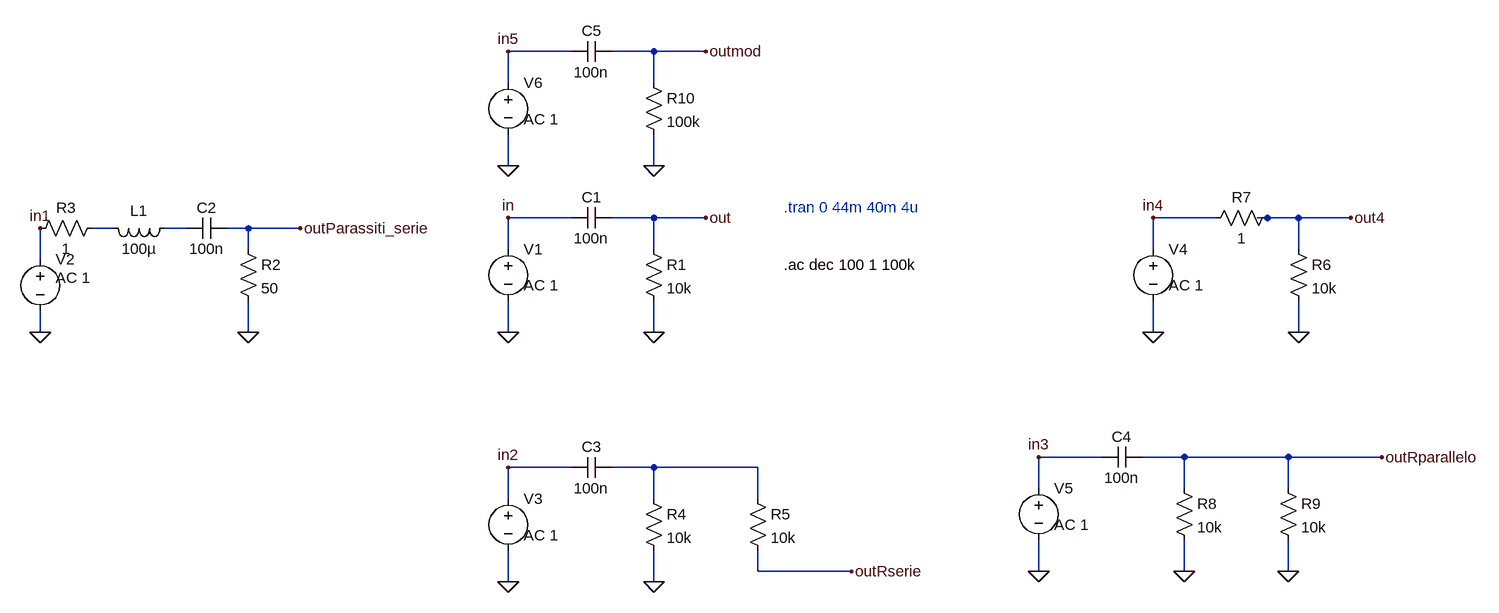
[diagram p0: schematic filto-passa-alto-rc-passivo.asc]
filto-passa-alto-rc-passivo.asc, the LTspice schematic file:
Version 4.1
SHEET 1 1500 748
WIRE 80 -112 -16 -112
WIRE 208 -112 144 -112
WIRE 288 -112 208 -112
WIRE -16 -64 -16 -112
WIRE 208 -64 208 -112
WIRE -16 64 -16 16
WIRE 208 64 208 16
WIRE 80 144 -16 144
WIRE 208 144 144 144
WIRE 288 144 208 144
WIRE 1072 144 976 144
WIRE 1152 144 1136 144
WIRE 1200 144 1152 144
WIRE 1280 144 1200 144
WIRE -624 160 -656 160
WIRE -512 160 -544 160
WIRE -416 160 -448 160
WIRE -336 160 -416 160
WIRE -416 192 -416 160
WIRE -16 192 -16 144
WIRE 208 192 208 144
WIRE 976 192 976 144
WIRE 1200 192 1200 144
WIRE -736 208 -736 160
WIRE -736 320 -736 288
WIRE -416 320 -416 272
WIRE -16 320 -16 272
WIRE 208 320 208 272
WIRE 976 320 976 272
WIRE 1200 320 1200 272
WIRE 896 512 800 512
WIRE 1024 512 960 512
WIRE 1184 512 1024 512
WIRE 1328 512 1184 512
WIRE 80 528 -16 528
WIRE 208 528 144 528
WIRE 368 528 208 528
WIRE 800 560 800 512
WIRE 1024 560 1024 512
WIRE 1184 560 1184 512
WIRE -16 576 -16 528
WIRE 208 576 208 528
WIRE 368 576 368 528
WIRE 368 688 368 656
WIRE 512 688 368 688
WIRE 800 688 800 640
WIRE 1024 688 1024 640
WIRE 1184 688 1184 640
WIRE -16 704 -16 656
WIRE 208 704 208 656
FLAG 208 320 0
FLAG -16 320 0
FLAG -16 144 in
FLAG 288 144 out
FLAG -736 320 0
FLAG -416 320 0
FLAG -336 160 outParassiti_serie
FLAG -736 160 in1
FLAG 208 704 0
FLAG -16 704 0
FLAG -16 528 in2
FLAG 512 688 outRserie
FLAG 1200 320 0
FLAG 976 320 0
FLAG 976 144 in4
FLAG 1280 144 out4
FLAG 1024 688 0
FLAG 800 688 0
FLAG 800 512 in3
FLAG 1184 688 0
FLAG 1328 512 outRparallelo
FLAG 208 64 0
FLAG -16 64 0
FLAG -16 -112 in5
FLAG 288 -112 outmod
SYMBOL cap 144 128 R90
WINDOW 0 0 32 VBottom 2
WINDOW 3 32 32 VTop 2
SYMATTR InstName C1
SYMATTR Value 100n
SYMATTR SpiceLine Rser=1 Lser=100u
SYMBOL res 192 176 R0
SYMATTR InstName R1
SYMATTR Value 10k
SYMATTR SpiceLine tol=1 pwr=0.1
SYMBOL voltage -16 176 R0
WINDOW 123 24 72 Left 2
WINDOW 39 0 0 Left 0
WINDOW 3 24 44 Left 2
SYMATTR Value2 AC 1
SYMATTR Value ""
SYMATTR InstName V1
SYMBOL voltage -736 192 R0
WINDOW 123 24 44 Left 2
WINDOW 39 0 0 Left 0
SYMATTR Value2 AC 1
SYMATTR InstName V2
SYMATTR Value ""
SYMBOL res -640 144 R90
WINDOW 0 0 56 VBottom 2
WINDOW 3 32 56 VTop 2
SYMATTR InstName R3
SYMATTR Value 1
SYMBOL ind -528 144 R90
WINDOW 0 5 56 VBottom 2
WINDOW 3 32 56 VTop 2
SYMATTR InstName L1
SYMATTR Value 100µ
SYMATTR SpiceLine Rser=1m
SYMBOL cap -448 144 R90
WINDOW 0 0 32 VBottom 2
WINDOW 3 32 32 VTop 2
SYMATTR InstName C2
SYMATTR Value 100n
SYMBOL res -432 176 R0
SYMATTR InstName R2
SYMATTR Value 50
SYMBOL cap 144 512 R90
WINDOW 0 0 32 VBottom 2
WINDOW 3 32 32 VTop 2
SYMATTR InstName C3
SYMATTR Value 100n
SYMBOL res 192 560 R0
SYMATTR InstName R4
SYMATTR Value 10k
SYMATTR SpiceLine tol=1 pwr=0.1
SYMBOL voltage -16 560 R0
WINDOW 123 24 72 Left 2
WINDOW 39 0 0 Left 0
WINDOW 3 24 44 Left 2
SYMATTR Value2 AC 1
SYMATTR Value ""
SYMATTR InstName V3
SYMBOL res 352 560 R0
SYMATTR InstName R5
SYMATTR Value 10k
SYMBOL res 1184 176 R0
SYMATTR InstName R6
SYMATTR Value 10k
SYMATTR SpiceLine tol=1 pwr=0.1
SYMBOL voltage 976 176 R0
WINDOW 123 24 72 Left 2
WINDOW 39 0 0 Left 0
WINDOW 3 24 44 Left 2
SYMATTR Value2 AC 1
SYMATTR Value ""
SYMATTR InstName V4
SYMBOL res 1168 128 R90
WINDOW 0 0 56 VBottom 2
WINDOW 3 32 56 VTop 2
SYMATTR InstName R7
SYMATTR Value 1
SYMBOL cap 960 496 R90
WINDOW 0 0 32 VBottom 2
WINDOW 3 32 32 VTop 2
SYMATTR InstName C4
SYMATTR Value 100n
SYMBOL res 1008 544 R0
SYMATTR InstName R8
SYMATTR Value 10k
SYMATTR SpiceLine tol=1 pwr=0.1
SYMBOL voltage 800 544 R0
WINDOW 123 24 72 Left 2
WINDOW 39 0 0 Left 0
WINDOW 3 24 44 Left 2
SYMATTR Value2 AC 1
SYMATTR Value ""
SYMATTR InstName V5
SYMBOL res 1168 544 R0
SYMATTR InstName R9
SYMATTR Value 10k
SYMBOL cap 144 -128 R90
WINDOW 0 0 32 VBottom 2
WINDOW 3 32 32 VTop 2
SYMATTR InstName C5
SYMATTR Value 100n
SYMATTR SpiceLine Rser=1 Lser=100u
SYMBOL res 192 -80 R0
SYMATTR InstName R10
SYMATTR Value 100k
SYMATTR SpiceLine tol=1 pwr=0.1
SYMBOL voltage -16 -80 R0
WINDOW 123 24 72 Left 2
WINDOW 39 0 0 Left 0
WINDOW 3 24 44 Left 2
SYMATTR Value2 AC 1
SYMATTR Value ""
SYMATTR InstName V6
TEXT 408 216 Left 2 !.ac dec 100 1 100k
TEXT 408 128 Left 2 ;.tran 0 44m 40m 4u

The netlist it stands for:
* filto-passa-alto-rc-passivo.asc
C1 out in 100n Rser=1 Lser=100u
R1 out 0 10k tol=1 pwr=0.1
V1 in 0 AC 1
V2 in1 0 AC 1
R3 N001 in1 1
L1 N002 N001 100µ Rser=1m
C2 outParassiti_serie N002 100n
R2 outParassiti_serie 0 50
C3 N003 in2 100n
R4 N003 0 10k tol=1 pwr=0.1
V3 in2 0 AC 1
R5 N003 outRserie 10k
R6 out4 0 10k tol=1 pwr=0.1
V4 in4 0 AC 1
R7 out4 in4 1
C4 outRparallelo in3 100n
R8 outRparallelo 0 10k tol=1 pwr=0.1
V5 in3 0 AC 1
R9 outRparallelo 0 10k
C5 outmod in5 100n Rser=1 Lser=100u
R10 outmod 0 100k tol=1 pwr=0.1
V6 in5 0 AC 1
.ac dec 100 1 100k
* .tran 0 44m 40m 4u
.backanno
.end